# EAGLE design SoftStart_V2_0 (EAGLE 6.1)
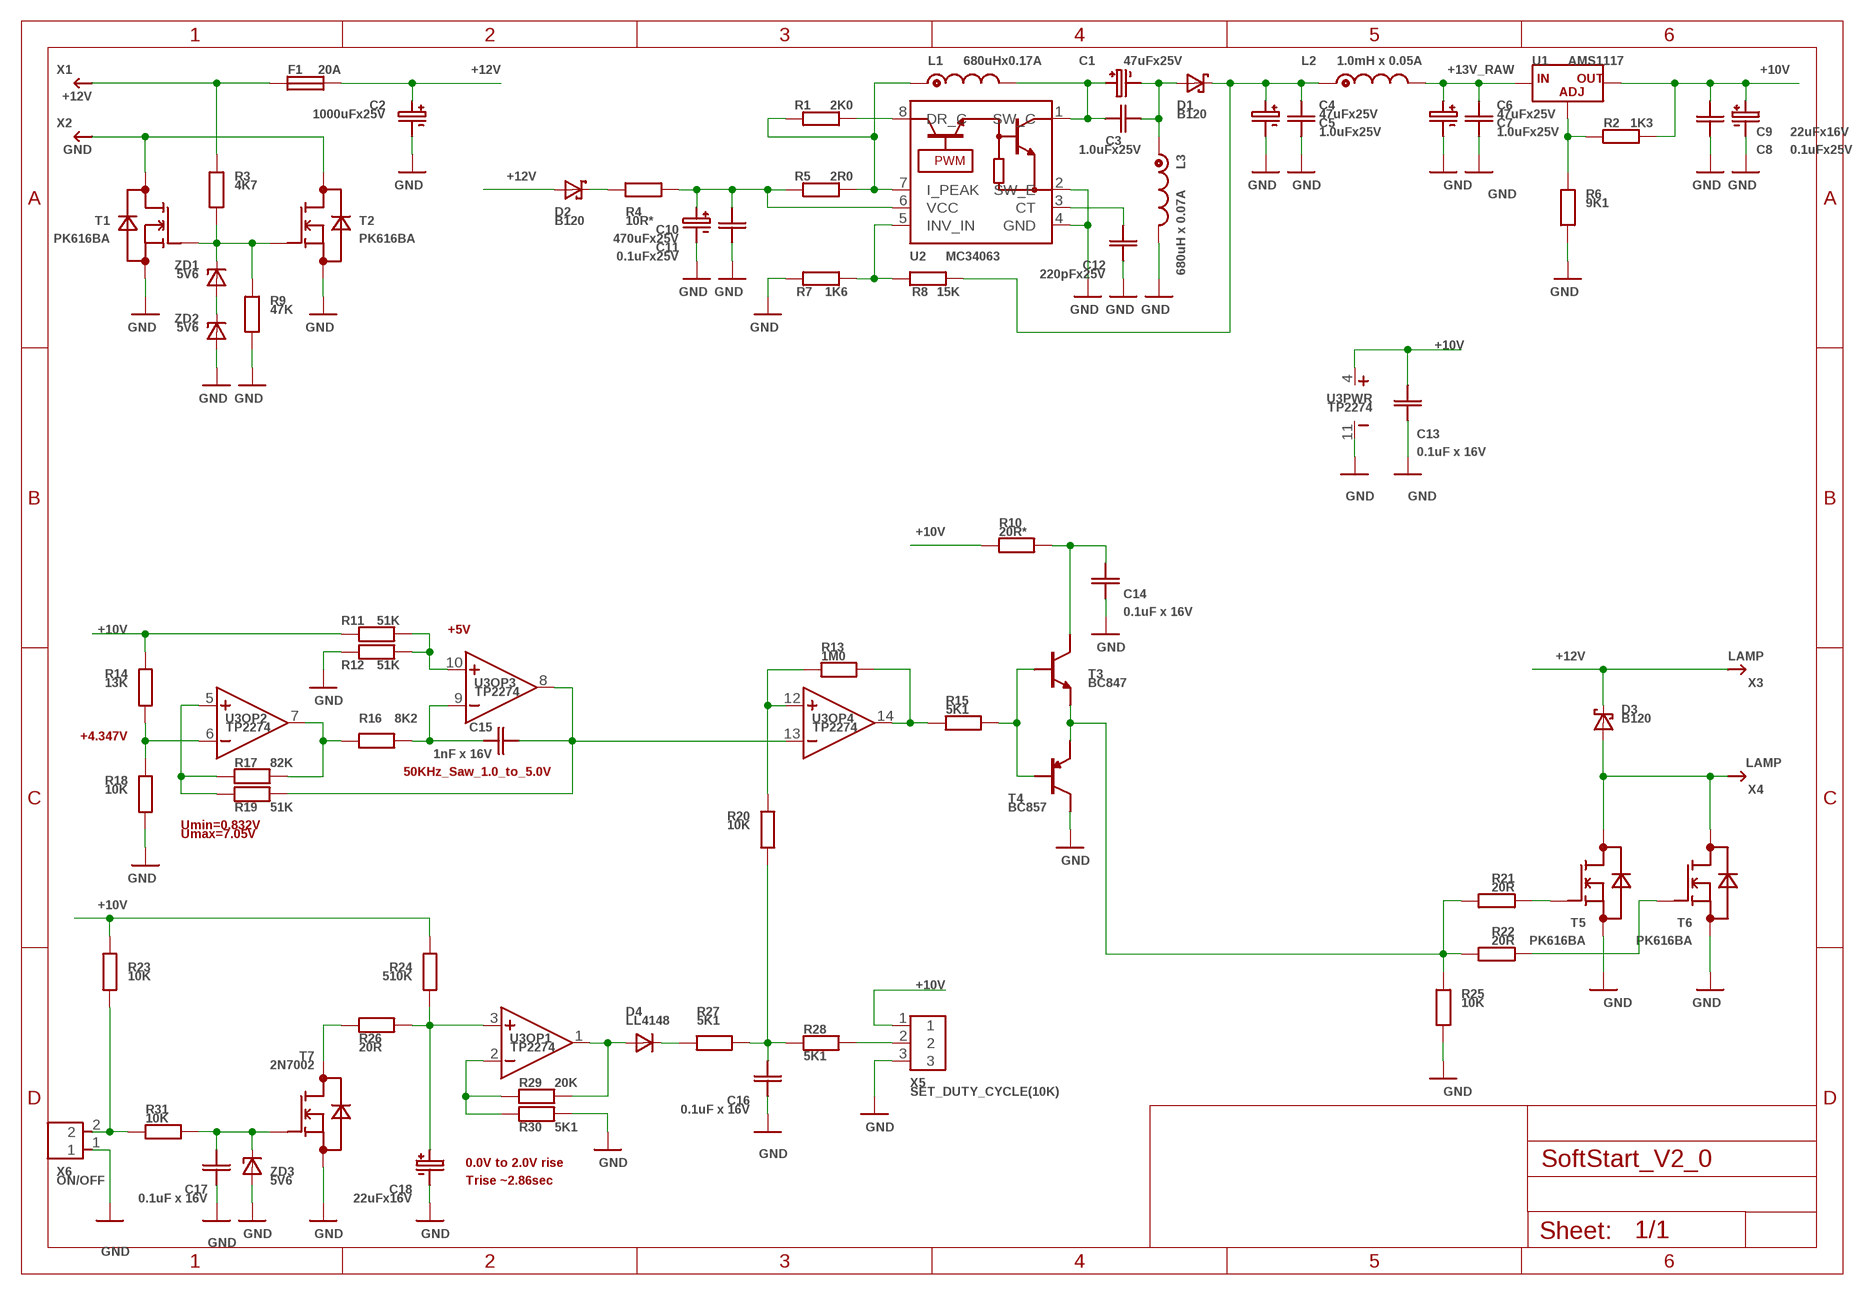
[diagram p0: schematic, sheet 1]

## Parts
C1  47uFx25V  CE6.3MM  [CE_6.3MM]
C2  1000uFx25V  CE10MM  [CE_10MM]
C3  1.0uFx25V  CSMD_1206  [RSMD_1206]
C4  47uFx25V  CE6.3MM  [CE_6.3MM]
C5  1.0uFx25V  CSMD_1206  [RSMD_1206]
C6  47uFx25V  CE6.3MM  [CE_6.3MM]
C7  1.0uFx25V  CSMD_1206  [RSMD_1206]
C8  0.1uFx25V  CSMD_0805  [RSMD_0805]
C9  22uFx16V  CE6.3MM  [CE_6.3MM]
C10  470uFx25V  CE10MM  [CE_10MM]
C11  0.1uFx25V  CSMD_1206  [RSMD_1206]
C12  220pFx25V  CSMD_0805  [RSMD_0805]
C13  0.1uF x 16V  CSMD_0805  [RSMD_0805]
C14  0.1uF x 16V  CSMD_0805  [RSMD_0805]
C15  1nF x 16V  CSMD_0805  [RSMD_0805]
C16  0.1uF x 16V  CSMD_0805  [RSMD_0805]
C17  0.1uF x 16V  CSMD_0805  [RSMD_0805]
C18  22uFx16V  CE6.3MM  [CE_6.3MM]
D1  B120  B120(DO-214AC)  [DO-214AC]
D2  B120  B120(DO-214AC)  [DO-214AC]
D3  B120  B120(DO-214AC)  [DO-214AC]
D4  LL4148  LL4147SOD-80  [SOD-80]
F1  20A  FUSEAUTO_MINI_TERMINALS  [FUSE_AUTO_MINI_ON_TERMINALS]
L1  680uHx0.17A  L(LCHB0608)  [LCHB0608]
L2  1.0mH x 0.05A  L(LCHB0608)  [LCHB0608]
L3  680uH x 0.07A  L(LCHB0608)  [LCHB0608]
R1  2K0  RSMD_0805  [RSMD_0805]
R2  1K3  RSMD_0805  [RSMD_0805]
R3  4K7  RSMD_0805  [RSMD_0805]
R4  10R*  RSMD_1206_BIG_GAP  [RSMD_1206_BIG_GAP]
R5  2R0  RSMD_1206_BIG_GAP  [RSMD_1206_BIG_GAP]
R6  9K1  RSMD_0805  [RSMD_0805]
R7  1K6  RSMD_0805  [RSMD_0805]
R8  15K  RSMD_0805  [RSMD_0805]
R9  47K  RSMD_0805  [RSMD_0805]
R10  20R*  RSMD_1206  [RSMD_1206]
R11  51K  RSMD_0805  [RSMD_0805]
R12  51K  RSMD_0805  [RSMD_0805]
R13  1M0  RSMD_0805  [RSMD_0805]
R14  13K  RSMD_0805  [RSMD_0805]
R15  5K1  RSMD_0805  [RSMD_0805]
R16  8K2  RSMD_0805  [RSMD_0805]
R17  82K  RSMD_0805  [RSMD_0805]
R18  10K  RSMD_0805  [RSMD_0805]
R19  51K  RSMD_0805  [RSMD_0805]
R20  10K  RSMD_1206_BIG_GAP  [RSMD_1206_BIG_GAP]
R21  20R  RSMD_0805  [RSMD_0805]
R22  20R  RSMD_0805  [RSMD_0805]
R23  10K  RSMD_0805  [RSMD_0805]
R24  510K  RSMD_0805  [RSMD_0805]
R25  10K  RSMD_0805  [RSMD_0805]
R26  20R  RSMD_0805  [RSMD_0805]
R27  5K1  RSMD_0805  [RSMD_0805]
R28  5K1  RSMD_0805  [RSMD_0805]
R29  20K  RSMD_0805  [RSMD_0805]
R30  5K1  RSMD_0805  [RSMD_0805]
R31  10K  RSMD_0805  [RSMD_0805]
T1  PK616BA  PK616BA(PDFN_5X6P)  [PDFN_5X6P]
T2  PK616BA  PK616BA(PDFN_5X6P)  [PDFN_5X6P]
T3  BC847  BC847SOT23  [SOT23]
T4  BC857  BC857SOT23  [SOT23]
T5  PK616BA  PK616BA(PDFN_5X6P)  [PDFN_5X6P]
T6  PK616BA  PK616BA(PDFN_5X6P)  [PDFN_5X6P]
T7  2N7002  2N7002SOT23  [SOT23]
U1  AMS1117  AMS1117SOT223_WS  [SOT223(WAVE_SOLDERING)]
U2  MC34063  MC34063(SO-8)  [SOIC8]
U3  TP2274  LM324  [SOIC14]
X1  +12V  RPI_MALE6.3_TWO_HOLES  [RPI_6.3]
X2  GND  RPI_MALE6.3_TWO_HOLES  [RPI_6.3]
X3  LAMP  RPI_MALE6.3_TWO_HOLES  [RPI_6.3]
X4  LAMP  RPI_MALE6.3_TWO_HOLES  [RPI_6.3]
X5  SET_DUTY_CYCLE(10K)  PIN1X3(2.54MM_WITH_CLAMP)  [PIN3X1_2.54MM_WITH_CLAMP]
X6  ON/OFF  PIN1X22.54MM_WITH_CLAMP  [PIN2X1_2.54_WITH_CLAMP]
ZD1  5V6  ZENNER(SOD_80)  [SOD-80]
ZD2  5V6  ZENNER(SOD_80)  [SOD-80]
ZD3  5V6  ZENNER(SOD_80)  [SOD-80]

## Nets
+10V: C8.PAD_1(PIN1) C9.PLUS C13.PAD_1(PIN1) R2.PAD_0(PIN0) R10.PAD_0(PIN0) R11.PAD_1(PIN1) R14.PAD_1(PIN1) R23.PAD_1(PIN1) R24.PAD_1(PIN1) U1.2(OUT) U1.4(OUT) U3.4(PWR:VCC) X5.1
+12V: C2.PLUS D2.ANODE D3.CATHODE F1.PAD0(PIN0) X3.PAD1 X3.PAD2
+13V_RAW: C6.PLUS C7.PAD_0(PIN0) L2.2(END) U1.3(IN)
GND: C2.MINUS C4.MINUS C5.PAD_1(PIN1) C6.MINUS C7.PAD_1(PIN1) C8.PAD_0(PIN0) C9.MINUS C10.MINUS C11.PAD_0(PIN0) C12.PAD_0(PIN0) C13.PAD_0(PIN0) C14.PAD_0(PIN0) C16.PAD_0(PIN0) C17.PAD_0(PIN0) C18.MINUS L3.2(END) R6.PAD_0(PIN0) R7.PAD_0(PIN0) R9.PAD_0(PIN0) R12.PAD_1(PIN1) R18.PAD_0(PIN0) R25.PAD_1(PIN1) R30.PAD_0(PIN0) T1.S1(SOURCE) T1.S2(SOURCE) T1.S3(SOURCE) T2.S1(SOURCE) T2.S2(SOURCE) T2.S3(SOURCE) T4.3(C) T5.S1(SOURCE) T5.S2(SOURCE) T5.S3(SOURCE) T6.S1(SOURCE) T6.S2(SOURCE) T6.S3(SOURCE) T7.2(SOURCE) U2.2(SW_E) U2.4(GND) U3.11(PWR:GND) X5.3 X6.1 ZD2.ANODE ZD3.ANODE
N$1: R3.PAD_0(PIN0) R9.PAD_1(PIN1) T1.G(GATE) T2.G(GATE) ZD1.CATHODE
N$2: T1.D1(DRAIN) T1.D2(DRAIN) T1.D3(DRAIN) T1.D4(DRAIN) T1.D(DRAIN) T2.D1(DRAIN) T2.D2(DRAIN) T2.D3(DRAIN) T2.D4(DRAIN) T2.D(DRAIN) X2.PAD1 X2.PAD2
N$3: ZD1.ANODE ZD2.CATHODE
N$4: F1.PAD1(PIN1) R3.PAD_1(PIN1) X1.PAD1 X1.PAD2
N$5: L1.1(START) R1.PAD_1(PIN1) R5.PAD_0(PIN0) U2.7(I_PEAK)
N$6: D2.CATHODE R4.PAD_1(PIN1)
N$7: R2.PAD_1(PIN1) R6.PAD_1(PIN1) U1.1(ADJ)
N$8: D3.ANODE T5.D1(DRAIN) T5.D2(DRAIN) T5.D3(DRAIN) T5.D4(DRAIN) T5.D(DRAIN) T6.D1(DRAIN) T6.D2(DRAIN) T6.D3(DRAIN) T6.D4(DRAIN) T6.D(DRAIN) X4.PAD1 X4.PAD2
N$9: R22.PAD_0(PIN0) T6.G(GATE)
N$10: R21.PAD_0(PIN0) T5.G(GATE)
N$11: D4.CATHODE R27.PAD_0(PIN0)
N$12: R17.PAD_0(PIN0) R19.PAD_0(PIN0) U3.5(OP2:IN+)
N$13: R16.PAD_0(PIN0) R17.PAD_1(PIN1) U3.7(OP2:OUT)
N$14: R14.PAD_0(PIN0) R18.PAD_1(PIN1) U3.6(OP2:IN-)
N$15: R29.PAD_1(PIN1) R30.PAD_1(PIN1) U3.2(OP1:IN-)
N$16: R11.PAD_0(PIN0) R12.PAD_0(PIN0) U3.10(OP3:IN+)
N$17: C15.PAD_1(PIN1) R16.PAD_1(PIN1) U3.9(OP3:IN-)
N$18: C15.PAD_0(PIN0) R19.PAD_1(PIN1) U3.8(OP3:OUT) U3.13(OP4:IN-)
N$19: D4.ANODE R29.PAD_0(PIN0) U3.1(OP1:OUT)
N$20: C16.PAD_1(PIN1) R20.PAD_0(PIN0) R27.PAD_1(PIN1) R28.PAD_1(PIN1)
N$22: C17.PAD_1(PIN1) R31.PAD_0(PIN0) T7.1(GATE) ZD3.CATHODE
N$23: R28.PAD_0(PIN0) X5.2
N$24: R13.PAD_0(PIN0) R20.PAD_1(PIN1) U3.12(OP4:IN+)
N$25: R13.PAD_1(PIN1) R15.PAD_0(PIN0) U3.14(OP4:OUT)
N$26: R15.PAD_1(PIN1) T3.1(B) T4.1(B)
N$27: R21.PAD_1(PIN1) R22.PAD_1(PIN1) R25.PAD_0(PIN0) T3.2(E) T4.2(E)
N$30: C14.PAD_1(PIN1) R10.PAD_1(PIN1) T3.3(C)
N$31: C1.PLUS C3.PAD_1(PIN1) L1.2(END) U2.1(SW_C)
N$32: C1.MINUS C3.PAD_0(PIN0) D1.ANODE L3.1(START)
N$33: C10.PLUS C11.PAD_1(PIN1) R4.PAD_0(PIN0) R5.PAD_1(PIN1) U2.6(VCC)
N$34: R1.PAD_0(PIN0) U2.8(DR_C)
N$35: C12.PAD_1(PIN1) U2.3(CT)
N$36: C4.PLUS C5.PAD_0(PIN0) D1.CATHODE L2.1(START) R8.PAD_1(PIN1)
N$37: R7.PAD_1(PIN1) R8.PAD_0(PIN0) U2.5(INV_IN)
N$39: R26.PAD_0(PIN0) T7.3(DRAIN)
N$40: C18.PLUS R24.PAD_0(PIN0) R26.PAD_1(PIN1) U3.3(OP1:IN+)
N$41: R23.PAD_0(PIN0) R31.PAD_1(PIN1) X6.2

## Notes on the sheet
- +5V
- +4.347V
- 50KHz_Saw_1.0_to_5.0V
- Umin=0.832V
- Umax=7.05V
- 0.0V to 2.0V rise
- Trise ~2.86sec

## Library data of the parts
C1 C2 C4 C6 C9 C10 C18 = __MyCommonLib1:CE
C3 C5 C7 C8 C11-C17 = __MyCommonLib1:C
D1-D3 = __MyCommonLib1:B120
D4 = __MyCommonLib1:LL4147
F1 = __MyCommonLib1:FUSE
L1-L3 = __MyCommonLib1:L
R1-R31 = __MyCommonLib1:R
T1 T2 T5 T6 = __MyCommonLib1:PK616BA
T3 = __MyCommonLib1:BC847
T4 = __MyCommonLib1:BC857
T7 = __MyCommonLib1:2N7002
U1 = __MyCommonLib1:AMS1117
U2 = __MyCommonLib1:MC34063
U3 = __MyCommonLib1:LM324
X1-X4 = __MyCommonLib1:RPI_MALE
X5 = __MyCommonLib1:PIN1X3
X6 = __MyCommonLib1:PIN1X2
ZD1-ZD3 = __MyCommonLib1:ZENNER

## Board
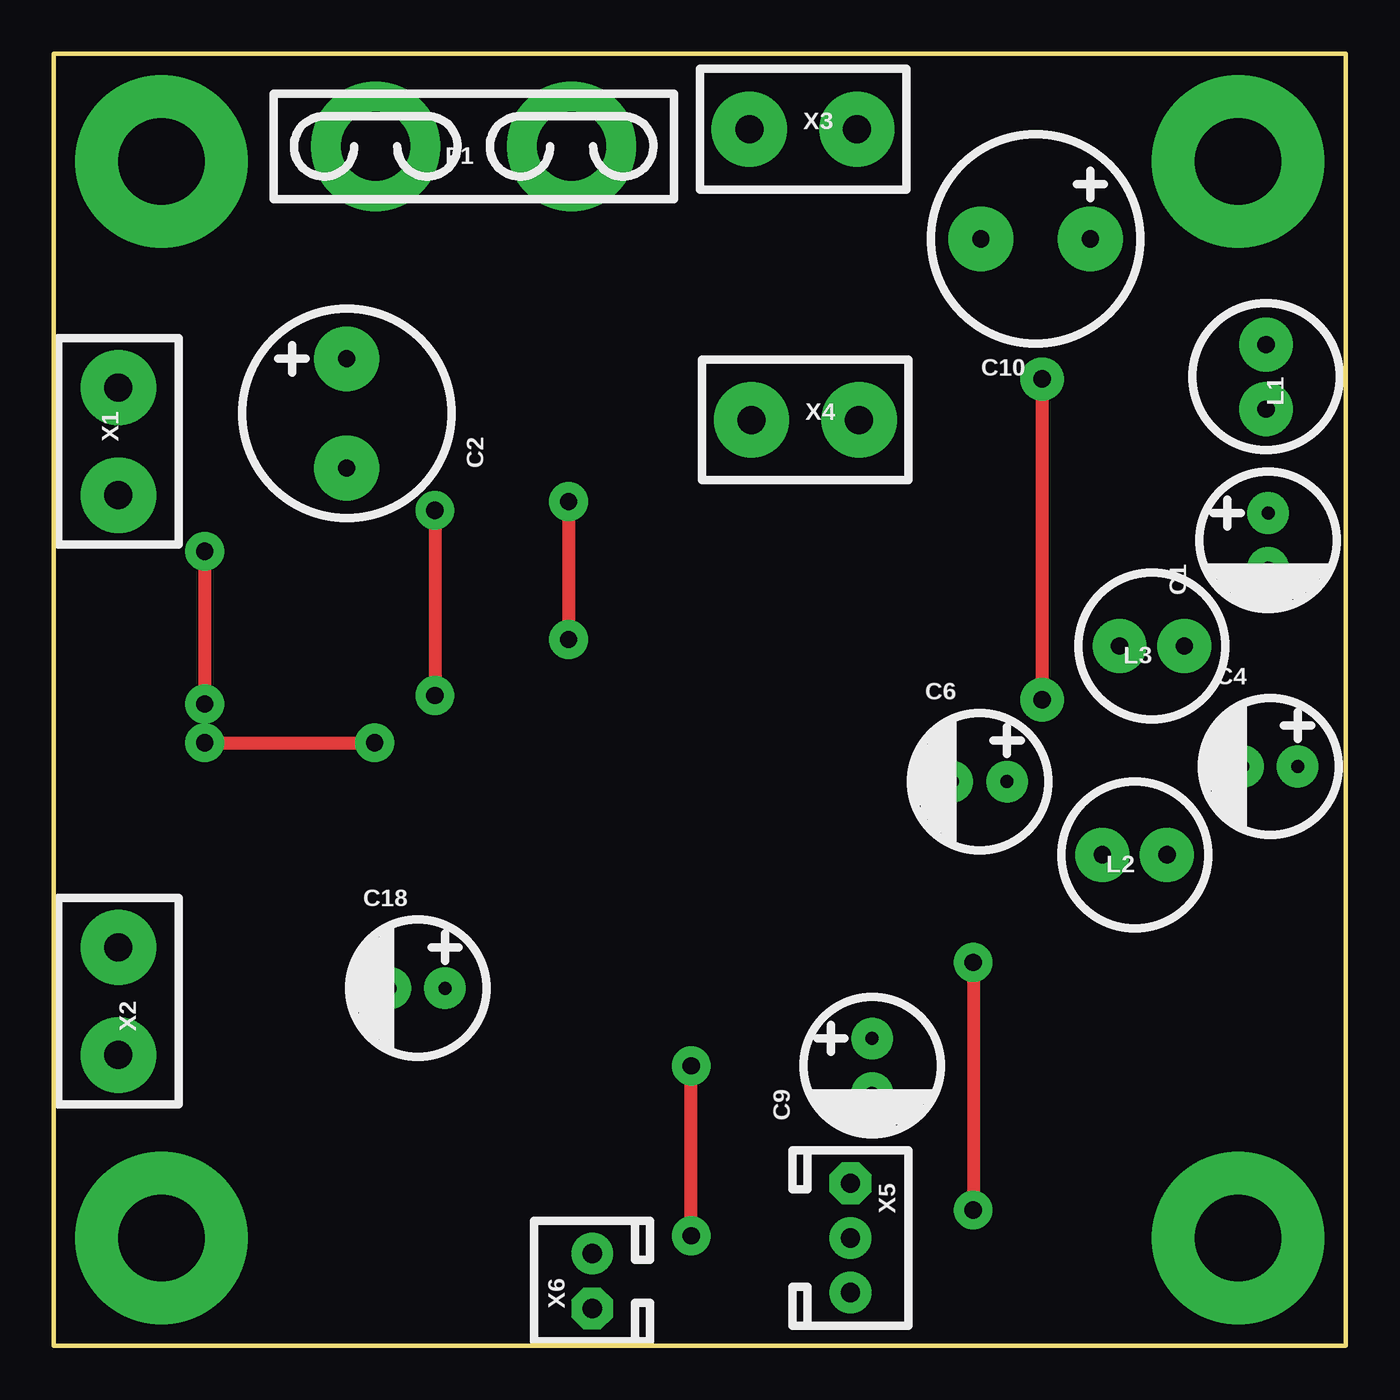
[diagram p1: board, top side]
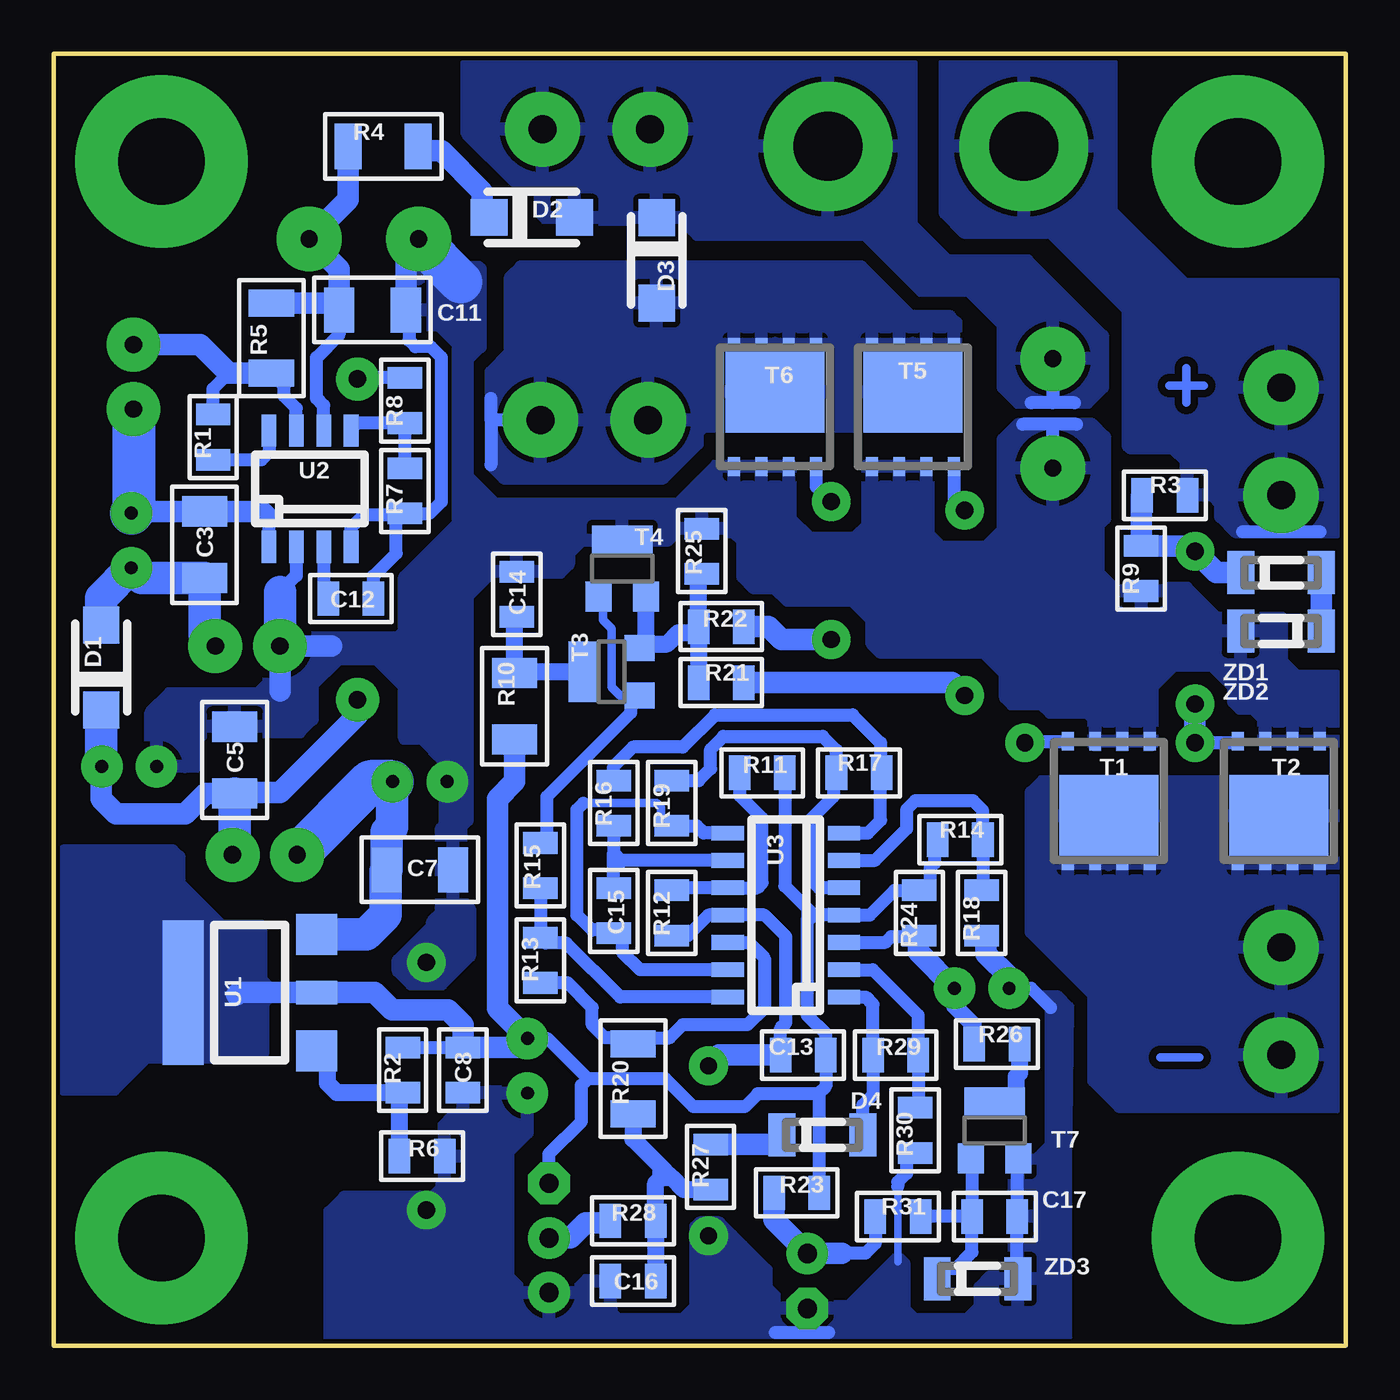
[diagram p2: board, bottom side, seen from below]

Size 60 x 60 mm. Coordinates in mm from the lower left corner, seen from the top.
Outline: 0,0 60,0 60,60 0,60 0,0
Copper layers (1*16): Top 0.035mm / dielectric 1.5mm / Bottom 0.035mm
Design rules: minimum track width 0.35mm, minimum drill 0.6mm, track to track 0.35mm, track to pad 0.35mm, pad to pad 0.35mm, via to via 0.35mm, smd to smd 0mil, copper to edge 0.2mm, drill to drill 8mil, minimum pad ring 10mil, minimum via ring 8mil, stop-mask expansion 4mil, vias tented up to drill 0mil, thermal gap 10mil

### Footprints (pad centres in the part's own frame; a part is rotated, then mirrored left to right if it is on the bottom)
CE_6.3MM = drill 0.6 pad 1.93: MINUS -1.27,0; PLUS 1.27,0
CE_10MM = drill 0.8 pad 3: MINUS -2.54,0; PLUS 2.54,0
RSMD_1206 = smd 1.4 x 2.1: PAD_0 -1.55,0; PAD_1 1.55,0
RSMD_0805 = smd 1 x 1.6: PAD_0 -1.05,0; PAD_1 1.05,0
DO-214AC = smd 1.72 x 1.68: ANODE 1.98,0; CATHODE -1.98,0
SOD-80 = smd 1.25 x 2: ANODE 1.875,0; CATHODE -1.875,0
FUSE_AUTO_MINI_ON_TERMINALS = drill 3.2 pad 6: PAD0 -4.55,0; PAD1 4.55,0
LCHB0608 = drill 0.8 pad 2.5: 1 -1.5,0; 2 1.5,0
RSMD_1206_BIG_GAP = smd 1.25 x 2.1: PAD_0 -1.625,0; PAD_1 1.625,0
PDFN_5X6P = smd 3.8 x 4.6: D 0.7,0 | smd 0.6 x 0.55: D1 2.9,-1.905; D2 2.9,-0.635; D3 2.9,0.635; D4 2.9,1.905 | smd 0.86 x 0.55: G -2.77,-1.905; S1 -2.77,-0.635; S2 -2.77,0.635; S3 -2.77,1.905
SOT23 = smd 1.2 x 1.4: 1 1.1,1.3; 2 -1.1,1.3 | smd 2.8 x 1.4: 3 0,-1.3
SOT223(WAVE_SOLDERING) = smd 1.9 x 1.9: 1 -2.7,-3.1; 3 2.7,-3.1 | smd 1.1 x 1.9: 2 0,-3.1 | smd 6.7 x 1.9: 4 0,3.1
SOIC8 = smd 1.5 x 0.68: 1 -2.699,1.905; 2 -2.699,0.635; 3 -2.699,-0.635; 4 -2.699,-1.905; 5 2.699,-1.905; 6 2.699,-0.635; 7 2.699,0.635; 8 2.699,1.905
SOIC14 = smd 1.5 x 0.68: 1 -2.699,3.81; 2 -2.699,2.54; 3 -2.699,1.27; 4 -2.699,0; 5 -2.699,-1.27; 6 -2.699,-2.54; 7 -2.699,-3.81; 8 2.699,-3.81; 9 2.699,-2.54; 10 2.699,-1.27; 11 2.699,0; 12 2.699,1.27; 13 2.699,2.54; 14 2.699,3.81
RPI_6.3 = drill 1.3 pad 3.5: PAD1 -2.5,0; PAD2 2.5,0
PIN3X1_2.54MM_WITH_CLAMP = drill 0.9 pad 1.93 octagon: 1 -2.54,0 | drill 0.9 pad 1.93: 2 0,0; 3 2.54,0
PIN2X1_2.54_WITH_CLAMP = drill 0.9 pad 1.93 octagon: 1 -1.27,0 | drill 0.9 pad 1.93: 2 1.27,0

### Placement (x,y rotation side)
C1  56.4,37.4 90 top
C2  13.6,43.3 90 top
C3  53,37.2 90 bottom
C4  56.5,26.9 0 top
C5  51.6,27.2 90 bottom
C6  43,26.2 0 top
C7  43,22.1 0 bottom
C8  41,12.8 90 bottom
C9  38,13 90 top
C10  45.6,51.4 0 top
C11  45.2,48.1 180 bottom
C12  46.2,34.7 180 bottom
C13  25.2,13.5 0 bottom
C14  38.5,34.9 270 bottom
C15  34,20.2 90 bottom
C16  33.1,3 0 bottom
C17  16.3,6 180 bottom
C18  16.9,16.6 0 top
D1  57.8,31.5 90 bottom
D2  37.8,52.4 0 bottom
D3  32,50.4 270 bottom
D4  24.3,9.8 0 bottom
F1  19.5,55.7 180 top
L1  56.3,45 270 top
L2  50.2,22.8 180 top
L3  51,32.5 180 top
R1  52.6,42.2 90 bottom
R2  43.8,12.8 270 bottom
R3  8.4,39.5 0 bottom
R4  44.7,55.7 0 bottom
R5  49.9,46.8 90 bottom
R6  42.9,8.8 180 bottom
R7  43.7,39.7 90 bottom
R8  43.7,43.9 90 bottom
R9  9.5,36.1 90 bottom
R10  38.6,29.7 90 bottom
R11  27.1,26.6 0 bottom
R12  31.3,20.1 270 bottom
R13  37.4,17.9 90 bottom
R14  17.9,23.5 180 bottom
R15  37.4,22.3 90 bottom
R16  34,25.2 270 bottom
R17  22.6,26.6 0 bottom
R18  16.9,20.1 90 bottom
R19  31.3,25.2 270 bottom
R20  33.1,12.4 90 bottom
R21  29,30.8 180 bottom
R22  29,33.4 180 bottom
R23  25.5,7.1 0 bottom
R24  19.8,20.1 90 bottom
R25  29.9,36.9 90 bottom
R26  16.2,14 180 bottom
R27  29.5,8.3 270 bottom
R28  33.1,5.8 0 bottom
R29  20.9,13.5 0 bottom
R30  20,10 90 bottom
R31  20.8,6 180 bottom
T1  11,25.3 270 bottom
T2  3.1,25.3 270 bottom
T3  34.1,31.3 270 bottom
T4  33.6,36.1 180 bottom
T5  20.1,43.6 90 bottom
T6  26.5,43.6 90 bottom
T7  16.3,10 180 bottom
U1  50.9,16.4 90 bottom
U2  48.1,39.8 90 bottom
U3  26,20 180 bottom
X1  3,42 90 top
X2  3,16 270 top
X3  34.8,56.5 0 top
X4  34.9,43 0 top
X5  37,5 270 top
X6  25,3 90 top
ZD1  3,35.9 0 bottom
ZD2  3,33.2 180 bottom
ZD3  17.1,3.1 0 bottom

### Tracks (layer width: path | path; a pad name or v marks a point on that pad's centre or on a via)
+10V
  Bottom 0.6: 24.5,11.7 24.15,12.05 C13.PAD_1 24.15,14.5 25,15.35 25,19.7 24.7,20 | 24.5,11.7 27.3,11.7 27.9,11.1 30.3,11.1 31.6,12.4 35.2,12.4 | R23.PAD_1 24.45,11.65 24.5,11.7 | 35.2,12.4 37.07,14.27 C9.PLUS | X5.1 37,8.9 35.5,10.4 35.5,12.1 35.2,12.4 | R2.PAD_0 C8.PAD_1 | R14.PAD_1 19.1,23.35 19.1,22.4 19.3,22.2 19.3,21.3 19.45,21.15 R24.PAD_1 20.95,21.15 22.1,20 U3.4 24.7,20 | 24.7,20 25,20.3 | 25,20.3 25,19.8 | R11.PAD_1 26.05,21.35 25,20.3
  Bottom 1: R10.PAD_0 38.6,26.2 39.4,25.4 39.4,15.67 C9.PLUS 38.42,13.85 C8.PAD_1 41,14.9 41.7,15.6 44.3,15.6 45.1,16.4 U1.2 51.4,16.4 51.5,16.3
  pour Bottom (no thermals): 49.8,16.4 50.3,15.9 50.3,13.6 50.5,13.4 55.7,13.4 57.2,11.9 59.5,11.9 59.5,23 54.5,23 54.2,22.7 54.2,21.5 52.2,19.5 50.4,19.5 50.4,17
+12V
  Bottom 0.6: 12.6,43.8 13.6,43.8 | 13.6,43.8 14.6,43.8 | 13.6,45.8 13.6,43.8
  pour Bottom: 11.3,46.9 11.3,44.5 12,43.8 15.2,43.8 15.9,44.5 15.9,47.4 17.5,49 19.7,49 22.3,51.6 30.1,51.6 30.8,52.3 37.1,52.3 37.4,52.6 37.4,53.5 38,54.1 38.6,54.1 40.8,56.3 40.8,59.6 20.2,59.6 20.2,52.1 18.5,50.4 14.8,50.4
+13V_RAW
  Bottom 1.5: C6.PLUS 44.3,26.17 44.3,24.1 44.55,23.85 C7.PAD_0 44.6,22.05 44.6,20 45.5,19.1 U1.3
  Bottom 2: C6.PLUS 45.3,26.2 L2.2
GND  (via drill 0.8 pad 1.8)
  Top 0.6: v42.7,17.8 v42.7,6.3 | v29.6,5.1 v29.6,13
  Bottom 0.35: 20.8,7.4 20.8,3.9
  Bottom 0.6: T7.2 15.25,8.65 C17.PAD_0 15.3,5.95 15.3,3.17 ZD3.ANODE | 13.7,15.7 14.6,16.6 C18.MINUS | U2.2 48.73,35.77 49.5,35 | R7.PAD_0 42.55,38.65 42,39.2 42,45.9 42.5,46.4 43.2,46.4 43.5,46.7 43.5,47.95 C11.PAD_0 | U2.4 46.2,38.01 45.6,38.6 43.7,38.6 R7.PAD_0 | C12.PAD_0 45.15,35.75 44.1,36.8 44.1,38.25 R7.PAD_0 | R12.PAD_1 30.55,19.05 29.6,20 U3.11 27,20 26,19 26,15 26.25,14.75 C13.PAD_0 | R30.PAD_0 20.4,8.55 20.4,8 20.8,7.6 20.8,7.4 | 24,0.6 26.5,0.6 | 12.5,42.8 13.6,42.8 | 13.6,42.8 15,42.8 | 13.6,40.8 13.6,42.8
  Bottom 1: C11.PAD_0 43.65,50.65 43.6,50.7 | C13.PAD_0 29.1,13.5 v29.6,13 | C18.MINUS 15.63,17.13 16.7,18.2 16.7,18.85 R18.PAD_0 | 47.1,32.5 L3.2 49.5,30.4
  Bottom 1.5: 49.5,35 L3.2
  Bottom 2: C10.MINUS 43.06,51.36 41.1,49.4
  pour Bottom: 0.4,28 3.8,28 3.8,29.1 4.3,29.6 4.9,29.6 5.2,29.9 5.2,30.6 6.2,31.6 8,31.6 9,30.6 9,27.9 11.7,27.9 11.7,29.1 12,29.4 13.7,29.4 14.1,29.8 15.5,29.8 15.8,30.1 15.8,31.2 16.8,32.2 21.6,32.2 22,32.6 22,33.7 22.9,34.6 25.9,34.6 26.5,35.2 27.5,35.2 28,35.7 28,37.4 28.4,37.8 31.1,37.8 31.5,37.4 35.5,37.4 36.1,36.8 36.1,36.3 36.5,35.9 39.7,35.9 40.8,34.8 40.8,24.4 41.1,24.1 41.1,20.7 40.7,20.3 40.7,18.1 42,16.8 43.4,16.8 44,17.4 44,17.9 42.4,19.5 42.4,19.7 42,20.1 42,24 41.8,24.2 41.8,27.1 42.9,28.2 43.7,28.2 43.7,30.6 45,31.9 46.8,31.9 48,30.7 48,29.1 48.6,28.5 53,28.5 53.4,28.1 53.4,26.9 53.9,26.9 54.3,26.5 55.5,26.5 55.5,29.4 54.6,30.3 50.5,30.3 50,30.8 50,32.9 44,32.9 43.7,33.2 43.7,35.7 41.2,38.2 41.2,46.5 42.1,47.4 43.8,47.4 43.8,50.8 43.1,51.5 43,51.5 41.6,50.1 40.3,50.1 40.2,50 40.2,46.4 40.8,45.8 40.8,40.4 39.5,39.1 31,39.1 29.2,40.9 25.8,40.9 25.8,38.4 24.9,37.5 22.8,37.5 22.2,38.1 22.2,40.9 19.5,40.9 19.5,40.3 19.4,40.2 19.4,37.7 18.8,37.1 16.7,37.1 15.9,37.9 15.9,42.1 15.2,42.8 11.8,42.8 11.2,42.2 11.2,38.4 11.5,38.1 11.5,35.9 10.8,35.2 7.4,35.2 6,33.8 3,33.8 3,31.8 2.3,31.1 0.4,31.1
  pour Bottom (no thermals): 40.8,27.5 40.8,24.8 41.8,24.8 41.8,27.1 42.4,27.7 40.8,27.7
  pour Bottom: 38,11.8 41.4,11.8 41.4,10.7 42,10.1 42,7.3 42.4,6.9 46.5,6.9 47.2,6.2 47.2,0.4 13,0.4 13,8.4 12.9,15.7 13.4,16.2 14.2,16.2 13.7,15.7 13.7,9.3 14.4,8.6 15.4,8.6 15.4,3.2 16.5,3.2 17,2.7 17,1.8 17.6,1.2 20,1.2 20.5,1.7 20.5,3.8 20.8,4.1 23.1,1.8 26,1.8 26.9,2.7 26.9,3.5 29.1,5.7 30,5.7 30.2,5.5 30.2,1.8 30.8,1.2 33.8,1.2 34.1,1.5 34.1,3.1 35.2,3.1 35.7,2.6 38.3,2.6 38.9,3.2 38.9,9 38,9.9
N$1  (via drill 0.8 pad 1.8)
  Top 0.6: v7,28 v14.9,28 | v7,36.9 v7,29.8
  Bottom 0.6: v14.9,28 14.83,28.07 T1.G | T2.G 5.08,28 v7,28
  Bottom 1: ZD1.CATHODE 6,35.9 v7,36.9 7.25,37.15 R9.PAD_1 9.5,39.45 R3.PAD_0 | v7,29.8 v7,28
N$2
  pour Bottom: 0.4,11.1 10.5,11.1 11.7,12.3 11.7,16.3 14.6,19.2 14.6,25.7 14,26.3 13.9,26.2 0.4,26.2
N$3
  Bottom 1: ZD1.ANODE ZD2.CATHODE
N$4
  Bottom 0.6: 1.2,37.8 3,37.8 | 3,37.8 4.8,37.8 | X1.PAD1 3,37.8
  pour Bottom: 0.4,37.8 5.1,37.8 5.8,38.5 5.8,39.1 6.2,39.5 7.4,39.5 7.4,41.1 8,41.7 10,41.7 10.1,41.8 10.1,48.1 13.7,51.7 17.7,51.7 18.6,52.6 18.6,59.6 10.9,59.6 10.9,52.7 7.5,49.3 0.4,49.3
N$5
  Bottom 0.6: U2.7 48.73,43.53 49.3,44.1 49.3,44.58 R5.PAD_0 | R1.PAD_1 52.6,44.45 51.88,45.17
  Bottom 1: R5.PAD_0 51.88,45.17 53.2,46.5 L1.1
N$6
  Bottom 1: D2.CATHODE 40.1,52.72 40.1,53.6 42,55.5 42.88,55.5 R4.PAD_1
N$7
  Bottom 0.78: U1.1 47.3,13.2 47.3,12.2 46.85,11.75 R2.PAD_1 43.95,11.6 R6.PAD_1
N$8
  Bottom 0.6: X4.PAD2 39.7,43 | 39.7,43 39.7,40.9 | 39.7,43 39.7,44
  pour Bottom: 18.1,42.7 18.1,47.5 18.4,47.8 20.2,47.8 22.5,50.1 38.3,50.1 38.8,49.6 38.8,46.1 39.7,45.2 39.7,40.9 39.1,40.3 31.7,40.3 30.1,41.9 30.1,42.4 29.8,42.7
N$9  (via drill 0.8 pad 1.8)
  Top 0.6: v23.9,39.2 v23.9,32.8
  Bottom 0.6: T6.G 24.59,39.9 v23.9,39.2
  Bottom 1: R22.PAD_0 26.8,33.4 26.2,32.8 v23.9,32.8
N$10  (via drill 0.8 pad 1.8)
  Top 0.6: v17.7,38.8 v17.7,30.2
  Bottom 0.6: T5.G 18.2,39.3 v17.7,38.8
  Bottom 1: R21.PAD_0 18.3,30.8 v17.7,30.2
N$11
  Bottom 1: R27.PAD_0 26.62,9.35 D4.CATHODE
N$12
  Bottom 0.6: R19.PAD_0 30.05,26.25 29.5,26.8 29.5,27.7 28.9,28.3 24.3,28.3 23.65,27.65 R17.PAD_0 23.8,26.45 23.8,25.5 24.9,24.4 24.9,21.7 24.47,21.27 U3.5
N$13
  Bottom 0.6: U3.7 22.19,23.81 21.6,24.4 21.6,26.55 R17.PAD_1 21.6,26.65 21.6,28 22.9,29.3 29.3,29.3 30.8,27.8 33.1,27.8 34,26.9 R16.PAD_0
N$14
  Bottom 0.6: U3.6 21.86,22.54 20.4,24 20.4,24.9 20,25.3 17.3,25.3 16.85,24.85 R14.PAD_0 16.85,21.2 R18.PAD_1
N$15
  Bottom 0.6: U3.2 21.96,17.46 19.85,15.35 R29.PAD_1 19.85,11.2 R30.PAD_1
N$16
  Bottom 0.6: R12.PAD_0 31.3,21.27 U3.10 27.33,21.27 27.1,21.5 27.1,24.5 28.15,25.55 R11.PAD_0
N$17
  Bottom 0.6: U3.9 33.56,22.54 33.6,22.5 | 33.6,22.5 34,22.1 | 34,22.1 34,22.9 | 34,22.9 33.6,22.5 | R16.PAD_1 34,22.9 | C15.PAD_1 34,22.1
N$18
  Bottom 0.4: 35.4,25.2 32,25.2 31.8,25 31.8,24.5 arc-90 31.45,24.15 R19.PAD_1
  Bottom 0.6: U3.8 29.81,23.81 30.15,24.15 R19.PAD_1 | U3.13 32.76,17.46 33.6,18.3 33.6,18.75 C15.PAD_0 34.15,19.3 35,19.3 35.7,20 35.7,24.9 35.4,25.2
N$19
  Bottom 0.6: D4.ANODE 22.43,11.18 21.95,11.65 R29.PAD_0 21.95,15.85 22.29,16.19 U3.1
N$20
  Bottom 0.8: C16.PAD_1 R28.PAD_1 32.05,7.55 31.8,7.8 | R27.PAD_1 30.75,7.25 31.3,7.8 31.8,7.8 | 31.8,7.8 31.8,8.3 | 31.8,8.3 31.4,7.9 | R20.PAD_0 33.1,9.6 31.8,8.3
N$21  (via drill 4 pad 8)
  other vias: 5,5
N$22
  Bottom 0.6: T7.1 17.35,8.65 C17.PAD_1 | C17.PAD_1 R31.PAD_0 | ZD3.CATHODE 18.48,3.6 18.1,3.6 17.35,4.35 C17.PAD_1
N$23
  Bottom 1: X5.2 36,5 35.3,5.7 34.25,5.7 R28.PAD_0
N$24
  Bottom 0.6: U3.12 27.73,18.73 27,18 27,15.7 27.8,14.9 30.8,14.9 31.4,14.3 32.83,14.3 R20.PAD_1 33.38,14.3 34.4,14.3 35,14.9 35,15.7 36.15,16.85 R13.PAD_0
N$25
  Bottom 0.6: U3.14 33.69,16.19 36.2,18.7 37.15,18.7 R13.PAD_1 R15.PAD_0
N$26
  Bottom 0.4: T3.1 33.7,30.2 34.1,30.6 34.1,33.3 34.5,33.7 34.5,34.6 T4.1
  Bottom 0.6: 34.6,34.7 T4.1 | R15.PAD_1 37.1,23.65 37.1,25.5 33.2,29.4 33.2,29.8 T3.1
N$27
  Bottom 0.8: T4.2 32.5,32.7 T3.2 32.6,32.6 31.5,32.6 31,33.1 30.05,33.1 | R25.PAD_0 30.05,35.85 R22.PAD_1 30.05,33.1 | 30.05,33.1 R21.PAD_1
N$28  (via drill 4 pad 8)
  other vias: 5,55
N$29  (via drill 4 pad 8)
  other vias: 55,55
N$30
  Bottom 0.8: C14.PAD_1 38.6,33.75 R10.PAD_1 38.55,31.3 T3.3
N$31
  Bottom 0.6: U2.1 50.01,38.4 50,38.4
  Bottom 1: C1.PLUS 56.32,38.75 C3.PAD_1 50.35,38.75 50,38.4
  Bottom 2: L1.2 56.3,38.77 C1.PLUS
N$32
  Bottom 1.5: L3.1 53,33 C3.PAD_0 55.92,35.65 C1.MINUS 57.8,34.73 D1.ANODE
N$33
  Bottom 0.6: U2.6 47.47,43.66 47.8,44 47.8,45.9 46.75,46.95 C11.PAD_1
  Bottom 1: R4.PAD_0 46.33,53.22 C10.PLUS 46.75,50.01 C11.PAD_1 47.08,48.42 R5.PAD_1
N$34
  Bottom 0.6: U2.8 50.01,41.49 50.35,41.15 R1.PAD_0
N$35
  Bottom 0.6: U2.3 47.47,34.91 C12.PAD_1
N$36  (via drill 0.8 pad 2)
  Top 0.6: v45.9,44.9 v45.9,30
  Bottom 0.6: R8.PAD_1 45.85,44.95 v45.9,44.9 | C4.PLUS 57.77,26.87 57.7,26.8
  Bottom 1: 57.7,26.8 57.8,26.7 57.8,25.4 57.1,24.7 53.9,24.7 52.95,25.65 C5.PAD_0 51.55,25.7 49.5,25.7 45.9,29.3 v45.9,30
  Bottom 1.5: D1.CATHODE 57.8,26.93 C4.PLUS | C5.PAD_0 51.6,22.9 L2.1
N$37
  Bottom 0.6: U2.5 arc90 45.84,42.85 R8.PAD_0 R7.PAD_1
N$38
  Bottom 0.4: 6.8,13.4 8.6,13.4
N$39
  Bottom 0.8: R26.PAD_0 15.15,12.65 15.3,12.5 15.3,11.3 T7.3
N$40
  Bottom 0.6: U3.3 21.37,18.73 21.1,19 19.85,19 R24.PAD_0
  Bottom 0.8: R26.PAD_1 17.3,14.05 17.3,14.9 18.17,15.77 C18.PLUS
  Bottom 1: 19.85,19 19.85,18.28 C18.PLUS
N$41
  Bottom 0.6: R31.PAD_1 21.85,4.75 22.3,4.3 23.4,4.3 | 24.97,4.3 X6.2 25,4.3
  Bottom 1: R23.PAD_0 26.55,5.85 25,4.3 | 24.97,4.3 23.4,4.3
N$42
  Bottom 0.4: 7.4,44.6 8.2,44.6 | 7.4,44.6 7.4,45.4 | 6.6,44.6 7.4,44.6 | 7.4,44.6 7.4,43.8
N$501  (via drill 4 pad 8)
  other vias: 55,5